# Altium project Shuttler_AMC.PrjPcb (part 13 of 20)

## Sheet Clock_Distribution_PLL.SchDoc: =ProjectName
size 420 x 297 mm; Author: T.P.; CompanyName: WUT; DrawnBy: T.P.; Organization: WUT ISE; Address1: Warsaw Univeristy of Technology; Address2: Nowowiejska 15/19; DocumentNumber: 16; Revision: 0.9; SheetNumber: 16; SheetTotal: 36; EDA_Number: ARTIQ; Projet: ARTIQ/SINARA; ModifiedBy: -; CreateDate: XX/XX/XXXX; CheckedDate: -; Title2: Clock_Distribution_PLL.SchDoc; DivGrp: ISE; Designer: G.K. and T.P.; ModifiedDate: -; ProjectName: ADC/DAC MEZZANINE
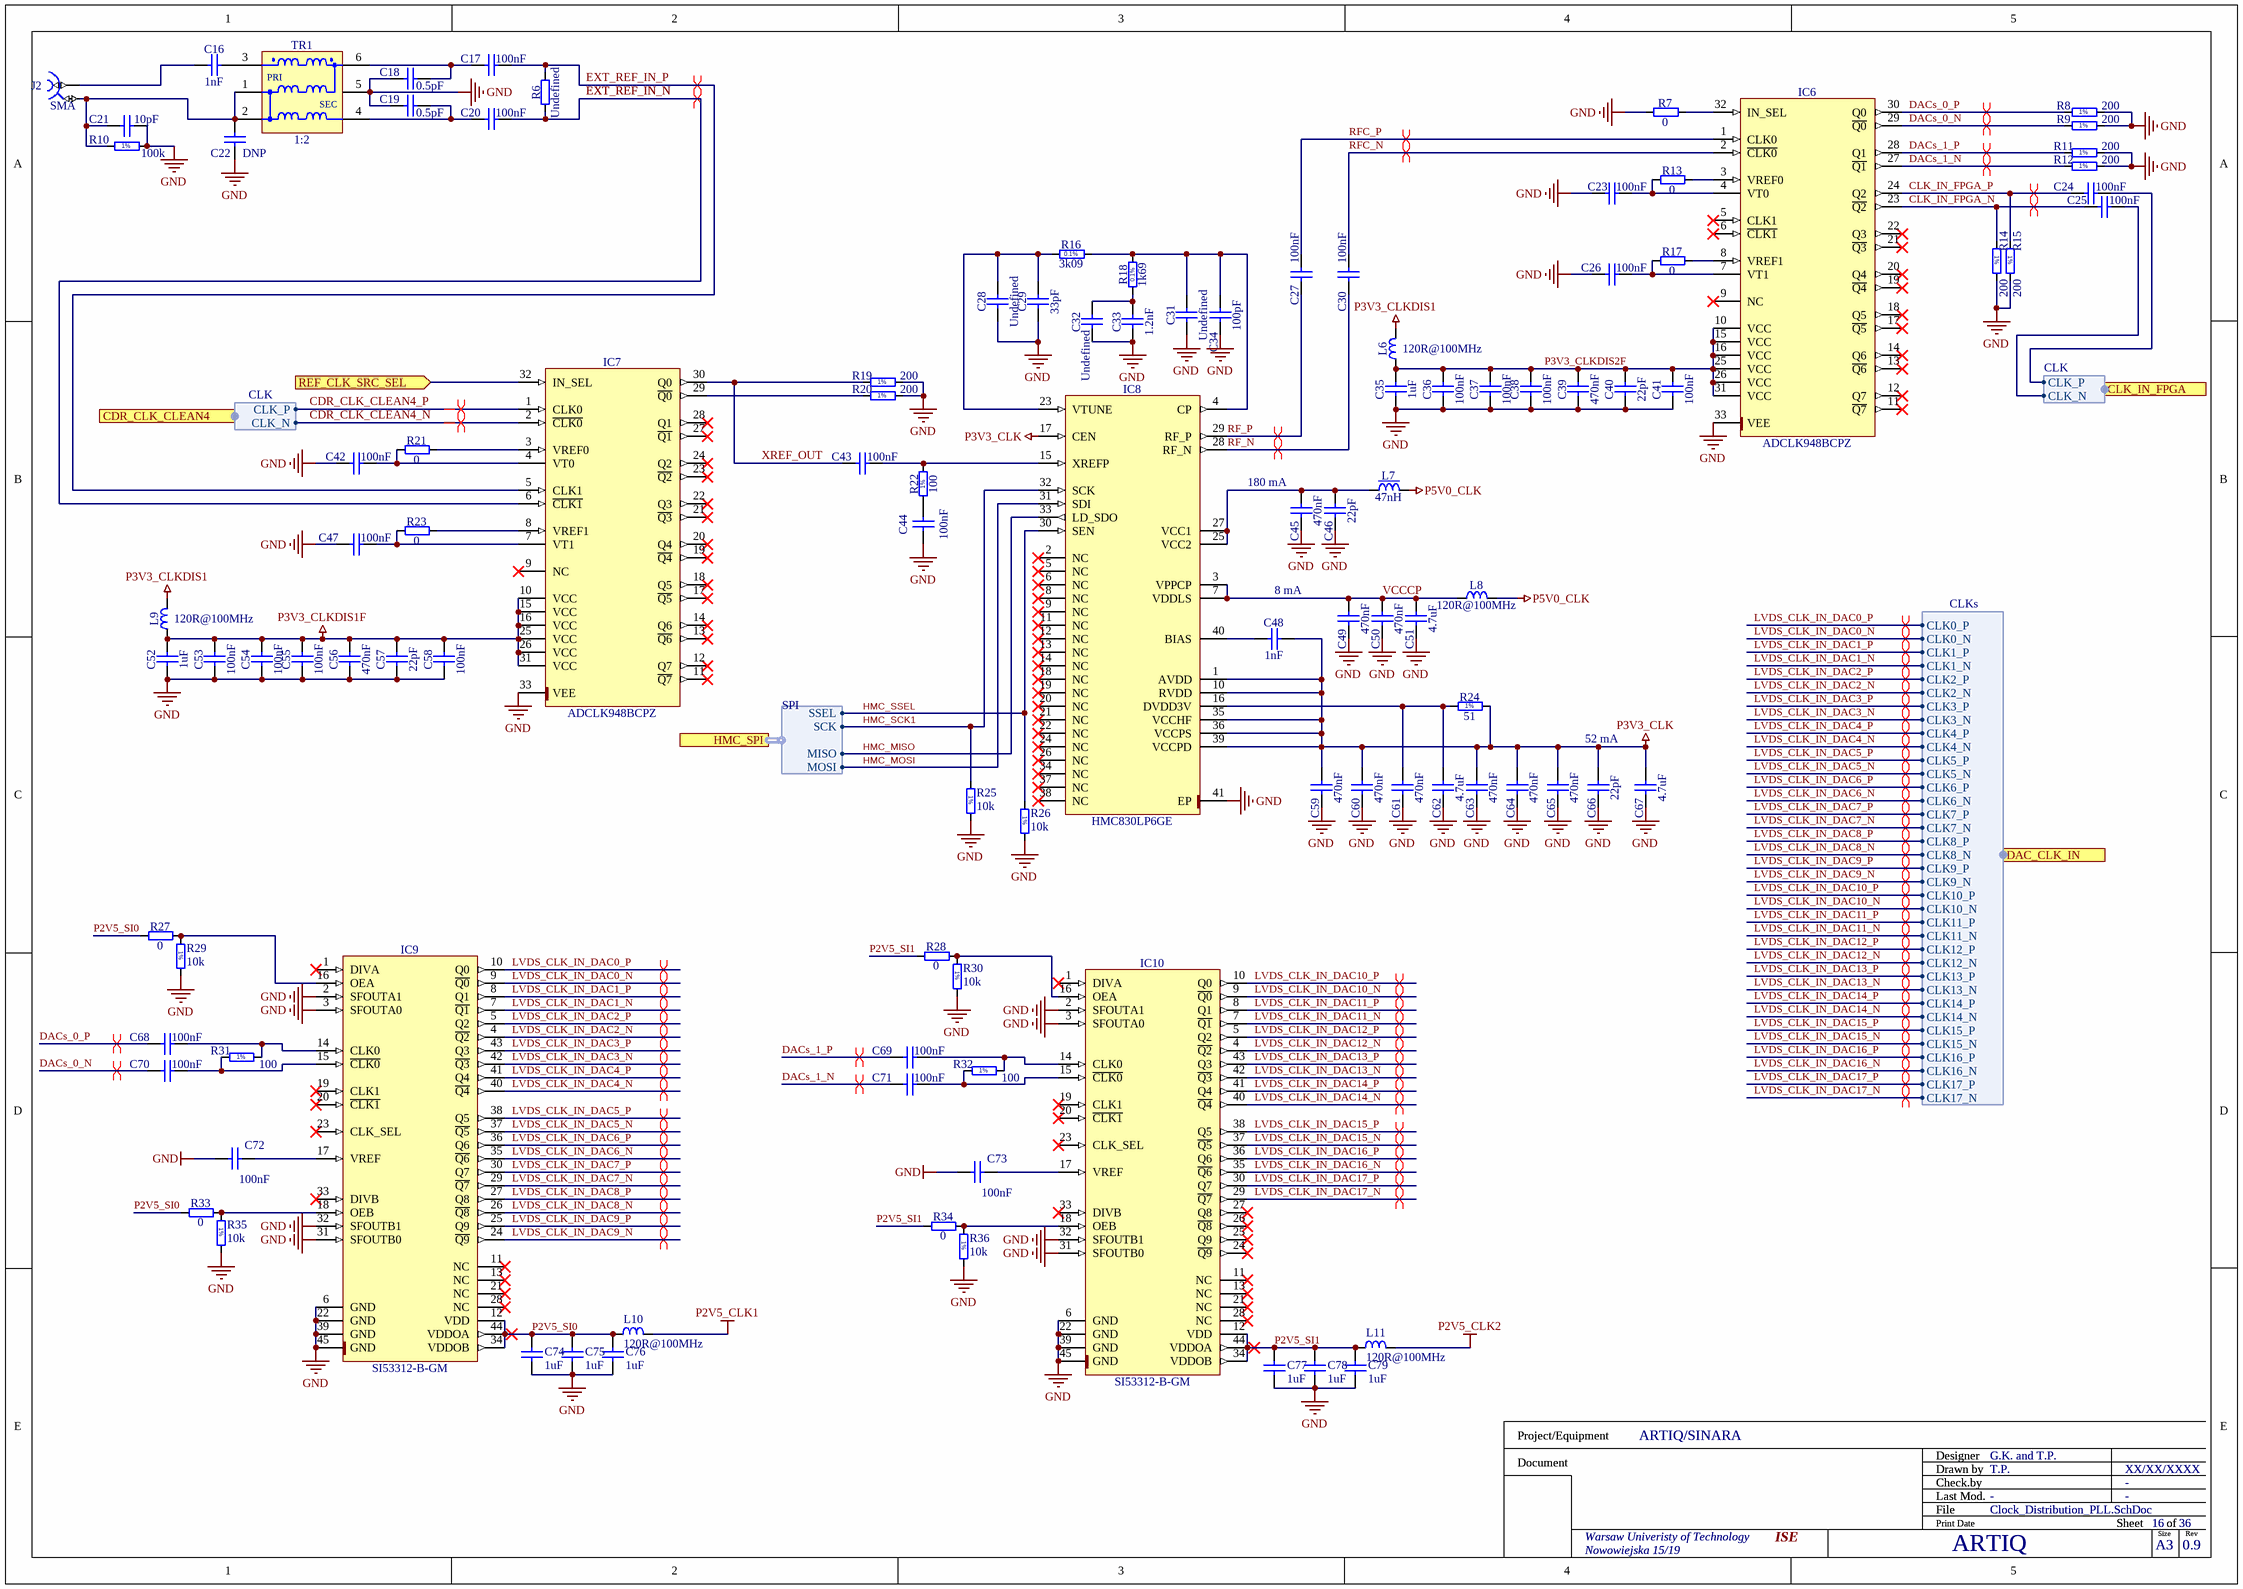
[diagram p24: Clock_Distribution_PLL.SchDoc]

### Parts
C16  1nF  [CAPC1005X55N]
C17  100nF  [CAPC0603X33N]
C18  0.5pF  [CAPC1005X50N]
C19  0.5pF  [CAPC1005X50N]
C20  100nF  [CAPC0603X33N]
C21  10pF  [CAPC1608X87N]
C22  DNP  [CAPC0603X33N]
C23  100nF  [CAPC0603X33N]
C24  100nF  [CAPC0603X33N]
C25  100nF  [CAPC0603X33N]
C26  100nF  [CAPC0603X33N]
C27  100nF  [CAPC0603X33N]
C28  Undefined  [CAPC2012X135N]
C29  33pF  [CAPC1608X87N]
C30  100nF  [CAPC0603X33N]
C31  Undefined  [CAPC2012X135N]
C32  Undefined  [CAPC2012X135N]
C33  1.2nF  [CAPC3216X140N]
C34  100pF  [CAPC1608X87N]
C35  1uF  [CAPC1005X55N]
C36  100nF  [CAPC0603X33N]
C37  100nF  [CAPC0603X33N]
C38  100nF  [CAPC0603X33N]
C39  470nF  [CAPC1005X55N]
C40  22pF  [CAPC1005X55N]
C41  100nF  [CAPC0603X33N]
C42  100nF  [CAPC0603X33N]
C43  100nF  [CAPC0603X33N]
C44  100nF  [CAPC0603X33N]
C45  470nF  [CAPC1005X55N]
C46  22pF  [CAPC1005X55N]
C47  100nF  [CAPC0603X33N]
C48  1nF  [CAPC1005X55N]
C49  470nF  [CAPC1005X55N]
C50  470nF  [CAPC1005X55N]
C51  4.7uF  [CAPC1608X90N]
C52  1uF  [CAPC1005X55N]
C53  100nF  [CAPC0603X33N]
C54  100nF  [CAPC0603X33N]
C55  100nF  [CAPC0603X33N]
C56  470nF  [CAPC1005X55N]
C57  22pF  [CAPC1005X55N]
C58  100nF  [CAPC0603X33N]
C59  470nF  [CAPC1005X55N]
C60  470nF  [CAPC1005X55N]
C61  470nF  [CAPC1005X55N]
C62  4.7uF  [CAPC1608X90N]
C63  470nF  [CAPC1005X55N]
C64  470nF  [CAPC1005X55N]
C65  470nF  [CAPC1005X55N]
C66  22pF  [CAPC1005X55N]
C67  4.7uF  [CAPC1608X90N]
C68  100nF  [CAPC0603X33N]
C69  100nF  [CAPC0603X33N]
C70  100nF  [CAPC0603X33N]
C71  100nF  [CAPC0603X33N]
C72  100nF  [CAPC1005X55N]
C73  100nF  [CAPC1005X55N]
C74  1uF  [CAPC1005X55N]
C75  1uF  [CAPC1005X55N]
C76  1uF  [CAPC1005X55N]
C77  1uF  [CAPC1005X55N]
C78  1uF  [CAPC1005X55N]
C79  1uF  [CAPC1005X55N]
IC6  ADCLK948BCPZ  [QFN50P500X500X80-33N-S285]
IC7  ADCLK948BCPZ  [QFN50P500X500X80-33N-S285]
IC8  HMC830LP6GE  [QFN50P600X600X90-41N-S475]
IC9  SI53312-B-GM  [QFN50P700X700X90-45N-S295]
IC10  SI53312-B-GM  [QFN50P700X700X90-45N-S295]
J2  SMA  [CINCH_142-0761-801]
L6  120R@100MHz  [INDC1608X95N]
L7  47nH  [INDC2014X145N]
L8  120R@100MHz  [INDC1608X95N]
L9  120R@100MHz  [INDC1608X95N]
L10  120R@100MHz  [INDC1608X95N]
L11  120R@100MHz  [INDC1608X95N]
R6  Undefined  [RESC1005X40N]
R7  0  [RESC1005X40N]
R8  200  [RESC1005X40N]
R9  200  [RESC1005X40N]
R10  100k  [RESC1608X55N]
R11  200  [RESC1005X40N]
R12  200  [RESC1005X40N]
R13  0  [RESC1005X40N]
R14  200  [RESC1005X40N]
R15  200  [RESC1005X40N]
R16  3k09  [RESC1608X55N]
R17  0  [RESC1005X40N]
R18  1k69  [RESC1608X55N]
R19  200  [RESC1005X40N]
R20  200  [RESC1005X40N]
R21  0  [RESC1005X40N]
R22  100  [RESC1005X40N]
R23  0  [RESC1005X40N]
R24  51  [RESC1005X40N]
R25  10k  [RESC1005X40N]
R26  10k  [RESC1005X40N]
R27  0  [RESC1608X55N]
R28  0  [RESC1608X55N]
R29  10k  [RESC1005X40N]
R30  10k  [RESC1005X40N]
R31  100  [RESC0603X28N]
R32  100  [RESC0603X28N]
R33  0  [RESC1608X55N]
R34  0  [RESC1608X55N]
R35  10k  [RESC1005X40N]
R36  10k  [RESC1005X40N]
TR1  1:2  [XFMR_MINI-CIRCUITS_DB1627]

### Ports
CDR_CLK_CLEAN4 (harness CLK), CLK_IN_FPGA (harness CLK), DAC_CLK_IN (harness CLKs), HMC_SPI (harness SPI), REF_CLK_SRC_SEL (in)

### Harnesses
CLK: CLK_P, CLK_N
CLKs: CLK0_P, CLK0_N, CLK1_P, CLK1_N, CLK2_P, CLK2_N, CLK3_P, CLK3_N, CLK4_P, CLK4_N, CLK5_P, CLK5_N, CLK6_P, CLK6_N, CLK7_P, CLK7_N, CLK8_P, CLK8_N, CLK9_P, CLK9_N, CLK10_P, CLK10_N, CLK11_P, CLK11_N, CLK12_P, CLK12_N, CLK13_P, CLK13_N, CLK14_P, CLK14_N, CLK15_P, CLK15_N, CLK16_P, CLK16_N, CLK17_P, CLK17_N
SPI: SCK, SSEL, MISO, MOSI

### Nets
GND: C18.1 C19.1 C21.2 C22.1 C23.1 C26.1 C28.1 C29.1 C31.1 C32.1 C33.1 C34.1 C35.1 C36.1 C37.1 C38.1 C39.1 C40.1 C41.1 C42.1 C44.1 C45.1 C46.1 C47.1 C49.1 C50.1 C51.1 C52.1 C53.1 C54.1 C55.1 C56.1 C57.1 C58.1 C59.1 C60.1 C61.1 C62.1 C63.1 C64.1 C65.1 C66.1 C67.1 C72.1 C73.1 C74.1 C75.1 C76.1 C77.1 C78.1 C79.1 IC6.33(VEE) IC7.33(VEE) IC8.41(EP) IC9.2(SFOUTA1) IC9.3(SFOUTA0) IC9.6(GND) IC9.22(GND) IC9.31(SFOUTB0) IC9.32(SFOUTB1) IC9.39(GND) IC9.45(GND) IC10.2(SFOUTA1) IC10.3(SFOUTA0) IC10.6(GND) IC10.22(GND) IC10.31(SFOUTB0) IC10.32(SFOUTB1) IC10.39(GND) IC10.45(GND) R7.1 R8.2 R9.2 R10.2 R11.2 R12.2 R14.2 R15.2 R19.2 R20.2 R25.2 R26.2 R29.2 R30.2 R35.2 R36.2 TR1.5(NC)
P2V5_CLK1: L10.2
P2V5_CLK2: L11.2
P3V3_CLK: C48.2 C59.2 C60.2 C63.2 C64.2 C65.2 C66.2 C67.2 IC8.1(AVDD) IC8.10(RVDD) IC8.17(CEN) IC8.35(VCCHF) IC8.36(VCCPS) IC8.39(VCCPD) R24.2
P3V3_CLKDIS1: L6.2 L9.2
P3V3_CLKDIS1F: C52.2 C53.2 C54.2 C55.2 C56.2 C57.2 C58.2 IC7.10(VCC) IC7.15(VCC) IC7.16(VCC) IC7.25(VCC) IC7.26(VCC) IC7.31(VCC) L9.1
P5V0_CLK: L7.2 L8.2
CDR_CLK_CLEAN4_N: IC7.2(~{CLK0}) ; port CDR_CLK_CLEAN4.CLK_N
CDR_CLK_CLEAN4_P: IC7.1(CLK0) ; port CDR_CLK_CLEAN4.CLK_P
CLK_IN_FPGA.CLK_N: C25.2 ; port CLK_IN_FPGA.CLK_N
CLK_IN_FPGA.CLK_P: C24.2 ; port CLK_IN_FPGA.CLK_P
CLK_IN_FPGA_N: C25.1 IC6.23(~{Q2}) R14.1
CLK_IN_FPGA_P: C24.1 IC6.24(Q2) R15.1
DACs_0_N: C70.1 IC6.29(~{Q0}) R9.1
DACs_0_P: C68.1 IC6.30(Q0) R8.1
DACs_1_N: C71.1 IC6.27(~{Q1}) R12.1
DACs_1_P: C69.1 IC6.28(Q1) R11.1
EXT_REF_IN_N: C20.2 IC7.6(~{CLK1}) R6.1
EXT_REF_IN_P: C17.2 IC7.5(CLK1) R6.2
HMC_MISO: IC8.33(LD_SDO) ; port HMC_SPI.MISO
HMC_MOSI: IC8.31(SDI) ; port HMC_SPI.MOSI
HMC_SCK1: IC8.32(SCK) R25.1 ; port HMC_SPI.SCK
HMC_SSEL: IC8.30(SEN) R26.1 ; port HMC_SPI.SSEL
LVDS_CLK_IN_DAC0_N: IC9.9(~{Q0}) ; port DAC_CLK_IN.CLK0_N  [project net DAC_CLK_IN.CLK0_N]
LVDS_CLK_IN_DAC0_P: IC9.10(Q0) ; port DAC_CLK_IN.CLK0_P  [project net DAC_CLK_IN.CLK0_P]
LVDS_CLK_IN_DAC1_N: IC9.7(~{Q1}) ; port DAC_CLK_IN.CLK1_N  [project net DAC_CLK_IN.CLK1_N]
LVDS_CLK_IN_DAC1_P: IC9.8(Q1) ; port DAC_CLK_IN.CLK1_P  [project net DAC_CLK_IN.CLK1_P]
LVDS_CLK_IN_DAC2_N: IC9.4(~{Q2}) ; port DAC_CLK_IN.CLK2_N  [project net DAC_CLK_IN.CLK2_N]
LVDS_CLK_IN_DAC2_P: IC9.5(Q2) ; port DAC_CLK_IN.CLK2_P  [project net DAC_CLK_IN.CLK2_P]
LVDS_CLK_IN_DAC3_N: IC9.42(~{Q3}) ; port DAC_CLK_IN.CLK3_N  [project net DAC_CLK_IN.CLK3_N]
LVDS_CLK_IN_DAC3_P: IC9.43(Q3) ; port DAC_CLK_IN.CLK3_P  [project net DAC_CLK_IN.CLK3_P]
LVDS_CLK_IN_DAC4_N: IC9.40(~{Q4}) ; port DAC_CLK_IN.CLK4_N  [project net DAC_CLK_IN.CLK4_N]
LVDS_CLK_IN_DAC4_P: IC9.41(Q4) ; port DAC_CLK_IN.CLK4_P  [project net DAC_CLK_IN.CLK4_P]
LVDS_CLK_IN_DAC5_N: IC9.37(~{Q5}) ; port DAC_CLK_IN.CLK5_N  [project net DAC_CLK_IN.CLK5_N]
LVDS_CLK_IN_DAC5_P: IC9.38(Q5) ; port DAC_CLK_IN.CLK5_P  [project net DAC_CLK_IN.CLK5_P]
LVDS_CLK_IN_DAC6_N: IC9.35(~{Q6}) ; port DAC_CLK_IN.CLK6_N  [project net DAC_CLK_IN.CLK6_N]
LVDS_CLK_IN_DAC6_P: IC9.36(Q6) ; port DAC_CLK_IN.CLK6_P  [project net DAC_CLK_IN.CLK6_P]
LVDS_CLK_IN_DAC7_N: IC9.29(~{Q7}) ; port DAC_CLK_IN.CLK7_N  [project net DAC_CLK_IN.CLK7_N]
LVDS_CLK_IN_DAC7_P: IC9.30(Q7) ; port DAC_CLK_IN.CLK7_P  [project net DAC_CLK_IN.CLK7_P]
LVDS_CLK_IN_DAC8_N: IC9.26(~{Q8}) ; port DAC_CLK_IN.CLK8_N  [project net DAC_CLK_IN.CLK8_N]
LVDS_CLK_IN_DAC8_P: IC9.27(Q8) ; port DAC_CLK_IN.CLK8_P  [project net DAC_CLK_IN.CLK8_P]
LVDS_CLK_IN_DAC9_N: IC9.24(~{Q9}) ; port DAC_CLK_IN.CLK9_N  [project net DAC_CLK_IN.CLK9_N]
LVDS_CLK_IN_DAC9_P: IC9.25(Q9) ; port DAC_CLK_IN.CLK9_P  [project net DAC_CLK_IN.CLK9_P]
LVDS_CLK_IN_DAC10_N: IC10.9(~{Q0}) ; port DAC_CLK_IN.CLK10_N  [project net DAC_CLK_IN.CLK10_N]
LVDS_CLK_IN_DAC10_P: IC10.10(Q0) ; port DAC_CLK_IN.CLK10_P  [project net DAC_CLK_IN.CLK10_P]
LVDS_CLK_IN_DAC11_N: IC10.7(~{Q1}) ; port DAC_CLK_IN.CLK11_N  [project net DAC_CLK_IN.CLK11_N]
LVDS_CLK_IN_DAC11_P: IC10.8(Q1) ; port DAC_CLK_IN.CLK11_P  [project net DAC_CLK_IN.CLK11_P]
LVDS_CLK_IN_DAC12_N: IC10.4(~{Q2}) ; port DAC_CLK_IN.CLK12_N  [project net DAC_CLK_IN.CLK12_N]
LVDS_CLK_IN_DAC12_P: IC10.5(Q2) ; port DAC_CLK_IN.CLK12_P  [project net DAC_CLK_IN.CLK12_P]
LVDS_CLK_IN_DAC13_N: IC10.42(~{Q3}) ; port DAC_CLK_IN.CLK13_N  [project net DAC_CLK_IN.CLK13_N]
LVDS_CLK_IN_DAC13_P: IC10.43(Q3) ; port DAC_CLK_IN.CLK13_P  [project net DAC_CLK_IN.CLK13_P]
LVDS_CLK_IN_DAC14_N: IC10.40(~{Q4}) ; port DAC_CLK_IN.CLK14_N  [project net DAC_CLK_IN.CLK14_N]
LVDS_CLK_IN_DAC14_P: IC10.41(Q4) ; port DAC_CLK_IN.CLK14_P  [project net DAC_CLK_IN.CLK14_P]
LVDS_CLK_IN_DAC15_N: IC10.37(~{Q5}) ; port DAC_CLK_IN.CLK15_N  [project net DAC_CLK_IN.CLK15_N]
LVDS_CLK_IN_DAC15_P: IC10.38(Q5) ; port DAC_CLK_IN.CLK15_P  [project net DAC_CLK_IN.CLK15_P]
LVDS_CLK_IN_DAC16_N: IC10.35(~{Q6}) ; port DAC_CLK_IN.CLK16_N  [project net DAC_CLK_IN.CLK16_N]
LVDS_CLK_IN_DAC16_P: IC10.36(Q6) ; port DAC_CLK_IN.CLK16_P  [project net DAC_CLK_IN.CLK16_P]
LVDS_CLK_IN_DAC17_N: IC10.29(~{Q7}) ; port DAC_CLK_IN.CLK17_N  [project net DAC_CLK_IN.CLK17_N]
LVDS_CLK_IN_DAC17_P: IC10.30(Q7) ; port DAC_CLK_IN.CLK17_P  [project net DAC_CLK_IN.CLK17_P]
P2V5_SI0: C74.2 C75.2 C76.2 IC9.12(VDD) IC9.34(VDDOB) IC9.44(VDDOA) L10.1 R27.1 R33.1
P2V5_SI1: C77.2 C78.2 C79.2 IC10.12(VDD) IC10.34(VDDOB) IC10.44(VDDOA) L11.1 R28.1 R34.1
P3V3_CLKDIS2F: C35.2 C36.2 C37.2 C38.2 C39.2 C40.2 C41.2 IC6.10(VCC) IC6.15(VCC) IC6.16(VCC) IC6.25(VCC) IC6.26(VCC) IC6.31(VCC) L6.1
REF_CLK_SEL: IC7.32(IN_SEL) ; port REF_CLK_SRC_SEL
RF_N: C30.1 IC8.28(RF_N)
RF_P: C27.1 IC8.29(RF_P)
RFC_N: C30.2 IC6.2(~{CLK0})
RFC_P: C27.2 IC6.1(CLK0)
VCCCP: C49.2 C50.2 C51.2 IC8.3(VPPCP) IC8.7(VDDLS) L8.1
XREF_OUT: C43.1 IC7.30(Q0) R19.1
NetC16_1: C16.1 J2.1
NetC16_2: C16.2 TR1.3(P1)
NetC17_1: C17.1 C18.2 TR1.6(S1)
NetC19_2: C19.2 C20.1 TR1.4(S1)
NetC21_1: C21.1 C22.2 J2.2 R10.1 TR1.1(P1) TR1.2(P1)
NetC23_2: C23.2 IC6.4(VT0) R13.1
NetC26_2: C26.2 IC6.7(VT1) R17.1
NetC28_2: C28.2 C29.2 IC8.23(VTUNE) R16.1
NetC31_2: C31.2 C34.2 IC8.4(CP) R16.2 R18.2
NetC32_2: C32.2 C33.2 R18.1
NetC42_2: C42.2 IC7.4(VT0) R21.1
NetC43_2: C43.2 IC8.15(XREFP) R22.2
NetC44_2: C44.2 R22.1
NetC45_2: C45.2 C46.2 IC8.25(VCC2) IC8.27(VCC1) L7.1
NetC47_2: C47.2 IC7.7(VT1) R23.1
NetC48_1: C48.1 IC8.40(BIAS)
NetC61_2: C61.2 C62.2 IC8.16(DVDD3V) R24.1
NetC68_2: C68.2 IC9.14(CLK0) R31.2
NetC69_2: C69.2 IC10.14(CLK0) R32.2
NetC70_2: C70.2 IC9.15(~{CLK0}) R31.1
NetC71_2: C71.2 IC10.15(~{CLK0}) R32.1
NetC72_2: C72.2 IC9.17(VREF)
NetC73_2: C73.2 IC10.17(VREF)
NetIC6_3: IC6.3(VREF0) R13.2
NetIC6_8: IC6.8(VREF1) R17.2
NetIC6_32: IC6.32(IN_SEL) R7.2
NetIC7_3: IC7.3(VREF0) R21.2
NetIC7_8: IC7.8(VREF1) R23.2
NetIC7_29: IC7.29(~{Q0}) R20.1
NetIC9_16: IC9.16(OEA) R27.2 R29.1
NetIC9_18: IC9.18(OEB) R33.2 R35.1
NetIC10_16: IC10.16(OEA) R28.2 R30.1
NetIC10_18: IC10.18(OEB) R34.2 R36.1

Not connected (* = marked no-connect by the designer): IC6 5(CLK1)* 6(~{CLK1})* 9(NC)* 11(~{Q7})* 12(Q7)* 13(~{Q6})* 14(Q6)* 17(~{Q5})* 18(Q5)* 19(~{Q4})* 20(Q4)* 21(~{Q3})* 22(Q3)*; IC7 9(NC)* 11(~{Q7})* 12(Q7)* 13(~{Q6})* 14(Q6)* 17(~{Q5})* 18(Q5)* 19(~{Q4})* 20(Q4)* 21(~{Q3})* 22(Q3)* 23(~{Q2})* 24(Q2)* 27(~{Q1})* 28(Q1)*; IC8 2(NC)* 5(NC)* 6(NC)* 8(NC)* 9(NC)* 11(NC)* 12(NC)* 13(NC)* 14(NC)* 18(NC)* 19(NC)* 20(NC)* 21(NC)* 22(NC)* 24(NC)* 26(NC)* 34(NC)* 37(NC)* 38(NC)*; IC9 1(DIVA)* 11(NC)* 13(NC)* 19(CLK1)* 20(~{CLK1})* 21(NC)* 23(CLK_SEL)* 28(NC)* 33(DIVB)*; IC10 1(DIVA)* 11(NC)* 13(NC)* 19(CLK1)* 20(~{CLK1})* 21(NC)* 23(CLK_SEL)* 24(~{Q9})* 25(Q9)* 26(~{Q8})* 27(Q8)* 28(NC)* 33(DIVB)*

### Layout directives
differential pair; differential pair class Diff_100Ohm: EXT_REF_IN_N, EXT_REF_IN_P, RF_N, RF_P, RFC_N, RFC_P
differential pair; differential pair class LVPECL: CDR_CLK_CLEAN4_N, CDR_CLK_CLEAN4_P, CLK_IN_FPGA_N, CLK_IN_FPGA_P, DACs_0_N, DACs_0_P, DACs_1_N, DACs_1_P
differential pair: DAC_CLK_IN.CLK0_N, DAC_CLK_IN.CLK0_P, DAC_CLK_IN.CLK1_N, DAC_CLK_IN.CLK1_P, DAC_CLK_IN.CLK2_N, DAC_CLK_IN.CLK2_P, DAC_CLK_IN.CLK3_N, DAC_CLK_IN.CLK3_P, DAC_CLK_IN.CLK4_N, DAC_CLK_IN.CLK4_P, DAC_CLK_IN.CLK5_N, DAC_CLK_IN.CLK5_P, DAC_CLK_IN.CLK6_N, DAC_CLK_IN.CLK6_P, DAC_CLK_IN.CLK7_N, DAC_CLK_IN.CLK7_P, DAC_CLK_IN.CLK8_N, DAC_CLK_IN.CLK8_P, DAC_CLK_IN.CLK9_N, DAC_CLK_IN.CLK9_P, DAC_CLK_IN.CLK10_N, DAC_CLK_IN.CLK10_P, DAC_CLK_IN.CLK11_N, DAC_CLK_IN.CLK11_P, DAC_CLK_IN.CLK12_N, DAC_CLK_IN.CLK12_P, DAC_CLK_IN.CLK13_N, DAC_CLK_IN.CLK13_P, DAC_CLK_IN.CLK14_N, DAC_CLK_IN.CLK14_P, DAC_CLK_IN.CLK15_N, DAC_CLK_IN.CLK15_P, DAC_CLK_IN.CLK16_N, DAC_CLK_IN.CLK16_P, DAC_CLK_IN.CLK17_N, DAC_CLK_IN.CLK17_P, DACs_0_N, DACs_0_P, DACs_1_N, DACs_1_P
differential pair; differential pair class LVDS: DAC_CLK_IN.CLK0_N, DAC_CLK_IN.CLK0_P, DAC_CLK_IN.CLK1_N, DAC_CLK_IN.CLK1_P, DAC_CLK_IN.CLK2_N, DAC_CLK_IN.CLK2_P, DAC_CLK_IN.CLK3_N, DAC_CLK_IN.CLK3_P, DAC_CLK_IN.CLK4_N, DAC_CLK_IN.CLK4_P, DAC_CLK_IN.CLK5_N, DAC_CLK_IN.CLK5_P, DAC_CLK_IN.CLK6_N, DAC_CLK_IN.CLK6_P, DAC_CLK_IN.CLK7_N, DAC_CLK_IN.CLK7_P, DAC_CLK_IN.CLK8_N, DAC_CLK_IN.CLK8_P, DAC_CLK_IN.CLK9_N, DAC_CLK_IN.CLK9_P, DAC_CLK_IN.CLK10_N, DAC_CLK_IN.CLK10_P, DAC_CLK_IN.CLK11_N, DAC_CLK_IN.CLK11_P, DAC_CLK_IN.CLK12_N, DAC_CLK_IN.CLK12_P, DAC_CLK_IN.CLK13_N, DAC_CLK_IN.CLK13_P, DAC_CLK_IN.CLK14_N, DAC_CLK_IN.CLK14_P, DAC_CLK_IN.CLK15_N, DAC_CLK_IN.CLK15_P, DAC_CLK_IN.CLK16_N, DAC_CLK_IN.CLK16_P, DAC_CLK_IN.CLK17_N, DAC_CLK_IN.CLK17_P

### Notes on the sheet
- (near C45) 180 mA
- 8 mA
- 52 mA
- Project/Equipment
- Document
- Designer
- Drawn by
- Check.by
- File
- Last Mod.
- Print Date
- Sheet
- Size
- A3
- of
- Rev
- (in symbol R0201_100R_1%_0.05W_200PPM) 1%
- (in symbol R0402_10K_1%_0.0625W_100PPM) 1%
- (in symbol R0402_51R_1%_0.0625W_100PPM) 1%
- (in symbol R0402_100R_1%_0.0625W_100PPM) 1%
- (in symbol R0402_200R_1%_0.0625W_100PPM) 1%
- (in symbol R0603_1K69_0.1%_0.063W_10PPM) 0.1%
- (in symbol R0603_3K09_0.1%_0.063W_10PPM) 0.1%
- (in symbol R0603_100K_1%_0.1W_100PPM) 1%
- (in symbol XFMR_MINI-CIRCUITS_TCM2-43X+) PRI; SEC

### Library data of the parts
C16 C48 = CC0402_1NF_50V_10%_X7R: Non-polarised capacitor; Part Description: SMD Multilayer Chip Ceramic Capacitor; Manufacturer: GENERIC; Manufacturer1 Part Number: 223858715623; Voltage: 50V; TC: X7R; Tolerance: ±10%; Part Number: CC0402_1NF_50V_10%_X7R; Component Kind: Standard; Component Type: Standard; Pin Count: 2; Value: 1nF; Status: Not Recommended; Manufacturer Part Number: CC0402_1NF_50V_10%_X7R; Case: 0402; Mounted: Yes; Socket: No; SMD: Yes; Sense: No; Manufacturer1 Example: PHYCOMP; Manufacturer1 ComponentHeight: 0.55mm; HelpURL: \\cern.ch\dfs\Applications\Altium\Datasheets\CC0402_X7R_PHYCOMP.pdf; Author: CERN DEM JLC; CreateDate: 03.12.2007; LatestRevisionDate: 03.12.2007
C17 C20 C22-C27 C30 C36-C38 C41-C44 C47 C53-C55 C58 C68-C71 = CC0201_100NF_6.3V_10%_X5R: as C1022 on sheet Amplifier; Part Number: CC0201_100NF_6.3V_10%_X5R; Component Kind: Standard; Component Type: Standard; Pin Count: 2; Status: Not Recommended; Manufacturer Part Number: CC0201_100NF_6.3V_10%_X5R; Case: 0201; Mounted: Yes; Socket: No; SMD: Yes; Sense: No; Manufacturer1 Example: AVX; Manufacturer1 ComponentHeight: 0.33mm; HelpURL: \\cern.ch\dfs\Applications\Altium\Datasheets\CC0201_X5R_AVX.pdf; Author: CERN DEM JLC; CreateDate: 03.12.2007; LatestRevisionDate: 03.12.2007
  C17 C20 C23-C27 C30 C36-C38 C41-C44 C47 C53-C55 C58 C68-C71: Value: 100nF
  C22: Value: DNP
C18 C19 = CC0402_0.5PF_25V_0.05PF_AVX_04023J0R5ABSTR: Non-polarised capacitor; Part Description: Thin-Film Chip Capacitors for RF Signal and Power Applications, Accu-P Series; Manufacturer: AVX; Voltage: 25V; Tolerance: ±0.05pF; Part Number: CC0402_0.5PF_25V_0.05PF_AVX_04023J0R5ABSTR; Component Kind: Standard; Component Type: Standard; Pin Count: 2; Value: 0.5pF; Status: None; Manufacturer Part Number: 04023J0R5ABSTR; Case: 0402; Mounted: Yes; Socket: No; SMD: Yes; Sense: No; ComponentHeight: 0.5mm; HelpURL: \\cern.ch\dfs\Applications\Altium\Datasheets\CC0402_AVX_ACCU-P.pdf; Author: CERN DEM JLC; CreateDate: 22.02.2017; LatestRevisionDate: 22.02.2017
C21 = CC0603_10PF_50V_5%_NP0: Non-polarised capacitor; Part Description: SMD Multilayer Chip Ceramic Capacitor; Manufacturer: GENERIC; Manufacturer1 Part Number: 223886715109; Voltage: 50V; TC: C0G/NP0; Tolerance: ±5%; Part Number: CC0603_10PF_50V_5%_NP0; Component Kind: Standard; Component Type: Standard; Pin Count: 2; Value: 10pF; Status: Preferred; Manufacturer Part Number: CC0603_10PF_50V_5%_NP0; Case: 0603; Mounted: Yes; Socket: No; SMD: Yes; Sense: No; Manufacturer1 Example: PHYCOMP; Manufacturer1 ComponentHeight: 0.87mm; HelpURL: \\cern.ch\dfs\Applications\Altium\Datasheets\CC0603_NP0_PHYCOMP.pdf; Author: CERN DEM JLC; CreateDate: 03.12.2007; LatestRevisionDate: 03.12.2007
C28 C31 C32 = CC0805_1.2NF_50V_10%_X7R: Non-polarised capacitor; Part Number: Capacitor - non polarized CAPC2012X135N; Part Description: Reserved Footprint For 0805(2012) Chip Ceramic Capacitor; Manufacturer Part Number: CC0805_NO-VALUE; Mounted: No; Component Kind: Standard; Component Type: Standard; Pin Count: 2; Value: Undefined; Manufacturer: Undefined; Case: 0805; Socket: No; SMD: Yes; Sense: No; Manufacturer1 ComponentHeight: 1.35mm; HelpURL: \\cern.ch\dfs\Applications\Altium\Datasheets\CC0805_X7R_PHYCOMP.pdf; Author: CERN DEM JLC; CreateDate: 03.12.2007; LatestRevisionDate: 03.12.2007
C29 = CC0603_33PF_50V_5%_NP0: Non-polarised capacitor; Part Description: SMD Multilayer Chip Ceramic Capacitor; Manufacturer: GENERIC; Manufacturer1 Part Number: 223886715339; Voltage: 50V; TC: C0G/NP0; Tolerance: ±5%; Part Number: CC0603_33PF_50V_5%_NP0; Component Kind: Standard; Component Type: Standard; Pin Count: 2; Value: 33pF; Status: Preferred; Manufacturer Part Number: CC0603_33PF_50V_5%_NP0; Case: 0603; Mounted: Yes; Socket: No; SMD: Yes; Sense: No; Manufacturer1 Example: PHYCOMP; Manufacturer1 ComponentHeight: 0.87mm; HelpURL: \\cern.ch\dfs\Applications\Altium\Datasheets\CC0603_NP0_PHYCOMP.pdf; Author: CERN DEM JLC; CreateDate: 03.12.2007; LatestRevisionDate: 03.12.2007
C33 = CC1206_1.2NF_50V_5%_NP0: Non-polarised capacitor; Part Description: SMD Multilayer Chip Ceramic Capacitor; Manufacturer: GENERIC; Manufacturer1 Part Number: 2238 863 15122; Voltage: 50V; TC: C0G/NP0; Tolerance: ±5%; Part Number: CC1206_1.2NF_50V_5%_NP0; Component Kind: Standard; Component Type: Standard; Pin Count: 2; Value: 1.2nF; Status: Preferred; Manufacturer Part Number: CC1206_1.2NF_50V_5%_NP0; Case: 1206; Mounted: Yes; Socket: No; SMD: Yes; Sense: No; Manufacturer1 Example: PHYCOMP; Manufacturer1 ComponentHeight: 1.25mm; HelpURL: \\cern.ch\dfs\Applications\Altium\Datasheets\CC1206_NP0_PHYCOMP.pdf; Author: CERN DEM JLC; CreateDate: 03.12.2007; LatestRevisionDate: 03.12.2007
C34 = CC0603_100PF_50V_5%_NP0: Non-polarised capacitor; Part Description: SMD Multilayer Chip Ceramic Capacitor; Manufacturer: GENERIC; Manufacturer1 Part Number: 223886715101; Voltage: 50V; TC: C0G/NP0; Tolerance: ±5%; Part Number: CC0603_100PF_50V_5%_NP0; Component Kind: Standard; Component Type: Standard; Pin Count: 2; Value: 100pF; Status: Preferred; Manufacturer Part Number: CC0603_100PF_50V_5%_NP0; Case: 0603; Mounted: Yes; Socket: No; SMD: Yes; Sense: No; Manufacturer1 Example: PHYCOMP; Manufacturer1 ComponentHeight: 0.87mm; HelpURL: \\cern.ch\dfs\Applications\Altium\Datasheets\CC0603_NP0_PHYCOMP.pdf; Author: CERN DEM JLC; CreateDate: 03.12.2007; LatestRevisionDate: 03.12.2007
C35 C52 C74-C79 = CC0402_1UF_16V_10%_X5R: Non-polarised capacitor; Part Description: SMD Multilayer Chip Ceramic Capacitor; Manufacturer: GENERIC; Manufacturer1 Part Number: C1005X5R1C105KT; Voltage: 16V; TC: X5R; Tolerance: ±10%; Part Number: CC0402_1UF_16V_10%_X5R; Component Kind: Standard; Component Type: Standard; Pin Count: 2; Value: 1uF; Status: Preferred; Manufacturer Part Number: CC0402_1UF_16V_10%_X5R; Case: 0402; Mounted: Yes; Socket: No; SMD: Yes; Sense: No; Manufacturer1 Example: TDK; Manufacturer1 ComponentHeight: 0.55mm; HelpURL: \\cern.ch\dfs\Applications\Altium\Datasheets\CC0402_X5R_TDK_C.pdf; Author: CERN DEM JLC
  C35 C52: CreateDate: 25.10.2012; LatestRevisionDate: 25.10.2012
  C74-C79: CreateDate: 2012-10-25; LatestRevisionDate: 2012-10-25
C39 C45 C49 C50 C56 C59-C61 C63-C65 = CC0402_470NF_16V_10%_X5R: Non-polarised capacitor; Part Description: SMD Multilayer Chip Ceramic Capacitor; Manufacturer: GENERIC; Manufacturer1 Part Number: C1005X5R1C105KT; Voltage: 16V; TC: X5R; Tolerance: ±10%; Part Number: CC0402_470NF_16V_10%_X5R; Component Kind: Standard; Component Type: Standard; Pin Count: 2; Value: 470nF; Status: Preferred; Manufacturer Part Number: CC0402_470NF_16V_10%_X5R; Case: 0402; Mounted: Yes; Socket: No; SMD: Yes; Sense: No; Manufacturer1 Example: TDK; Manufacturer1 ComponentHeight: 0.55mm; HelpURL: \\cern.ch\dfs\Applications\Altium\Datasheets\CC0402_X5R_TDK_C.pdf; Author: CERN DEM JLC; CreateDate: 25.10.2012; LatestRevisionDate: 25.10.2012
C40 C46 C57 C66 = CC0402_22PF_50V_5%_C0G: Non-polarised capacitor; Part Description: SMD Multilayer Chip Ceramic Capacitor; Manufacturer: GENERIC; Manufacturer1 Part Number: C0402C220J5GACTU; Voltage: 50V; TC: C0G/NP0; Tolerance: ±5%; Part Number: CC0402_22PF_50V_5%_C0G; Component Kind: Standard; Component Type: Standard; Pin Count: 2; Value: 22pF; Status: Preferred; Manufacturer Part Number: CC0402_22PF_50V_5%_C0G; Case: 0402; Mounted: Yes; Socket: No; SMD: Yes; Sense: No; Manufacturer1 Example: KEMET; Manufacturer1 ComponentHeight: 0.55mm; HelpURL: \\cern.ch\dfs\Applications\Altium\Datasheets\CC0805_C0G_KEMET_(Commercial Grade).pdf; Author: CERN DEM JLC; CreateDate: 03.12.2007; LatestRevisionDate: 03.12.2007
C51 C62 C67 = CC0603_4.7UF_25V_10%_X5R: Non-polarised capacitor; Part Description: SMD Multilayer Chip Ceramic Capacitor; Manufacturer: GENERIC; Manufacturer1 Part Number: GRM188R61E475KE11D; Voltage: 25V; TC: X5R; Tolerance: ±10%; Part Number: CC0603_4.7UF_25V_10%_X5R; Component Kind: Standard; Component Type: Standard; Pin Count: 2; Value: 4.7uF; Status: None; Manufacturer Part Number: CC0603_4.7UF_25V_10%_X5R; Case: 0603; Mounted: Yes; Socket: No; SMD: Yes; Sense: No; Manufacturer1 Example: MURATA; Manufacturer1 ComponentHeight: 0.95mm; HelpURL: \\cern.ch\dfs\Applications\Altium\Datasheets\CC0603_MURATA_GRM188R61E475KE11D.pdf; Author: CERN DEM JLC; CreateDate: 10.11.2014; LatestRevisionDate: 10.11.2014
C72 C73 = CC0402_100NF_16V_10%_X5R: Non-polarised capacitor; Part Description: SMD Multilayer Chip Ceramic Capacitor; Manufacturer: GENERIC; Manufacturer1 Part Number: GRM155R61C104KA88D; Voltage: 16V; TC: X5R; Tolerance: ±10%; Part Number: CC0402_100NF_16V_10%_X5R; Component Kind: Standard; Component Type: Standard; Pin Count: 2; Value: 100nF; Status: None; Manufacturer Part Number: CC0402_100NF_16V_10%_X5R; Case: 0402; Mounted: Yes; Socket: No; SMD: Yes; Sense: No; Manufacturer1 Example: MURATA; Manufacturer1 ComponentHeight: 0.55mm; HelpURL: \\cern.ch\dfs\Applications\Altium\Datasheets\CC0402_X5R_MURATA_GRM.pdf; Author: CERN DEM JLC; CreateDate: 10.12.2013; LatestRevisionDate: 10.12.2013
IC6 IC7 = ADCLK948BCPZ: Two Selectable Inputs, 8 LVPECL Outputs, SiGe Clock Fanout Buffer; Manufacturer: ANALOG DEVICES; PressFit: No; Bonding: No; Part Number: ADCLK948BCPZ; Component Kind: Standard; Component Type: Standard; Device: ADCLK948BCPZ; PackageDescription: QFN, 0.50mm Pitch, Square; 8 Pin X 8 Pin, 5mm X 5mm X 1.00mm H body (w/thermal tab 2.85 X 2.85mm),  IPC Medium Density; Part Description: Two Selectable Inputs, 8 LVPECL Outputs, SiGe Clock Fanout Buffer; Manufacturer Part Number: ADCLK948BCPZ; Pin Count: 33; Case: QFN32; Mounted: Yes; Socket: No; SMD: Yes; Sense: No; ComponentHeight: 0.8mm; Author: CERN DEM MR; HelpURL: \\cern.ch\dfs\Applications\Altium\Datasheets\ADCLK948BCPZ.pdf; CreateDate: 30.11.2016; LatestRevisionDate: 30.11.2016
IC8 = HMC830LP6GE: Fractional-N PLL With Integrated VCO, 25 to 3000MHz; Manufacturer: HITTITE MICROWAVE CORP; PressFit: No; Bonding: No; Part Number: HMC830LP6GE; Component Kind: Standard; Component Type: Standard; Device: HMC830LP6GE; PackageDescription: QFN, 0.50mm Pitch, Square; 40 Pin, 4.00mm L X 4.00mm W X 1.00mm H Body (w/thermal Tab 2.95 X 2.95mm), IPC Medium Density; Part Description: Fractional-N PLL With Integrated VCO, 25 to 3000MHz; Manufacturer Part Number: HMC830LP6GE; Pin Count: 41; Case: QFN40; Mounted: Yes; Socket: No; SMD: Yes; Sense: No; ComponentHeight: 0.9mm; Author: CERN DEM JMW; HelpURL: \\cern.ch\dfs\Applications\Altium\Datasheets\HMC830LP6GE.pdf; CreateDate: 17.08.2016; LatestRevisionDate: 17.08.2016
IC9 IC10 = SI53312-B-GM: 2 Input/10 Output, Low Jitter Universal Buffer/Level Translator With 2:1 Input Mux (<1.25 GHZ); Manufacturer: SILICON LABS; PressFit: No; Bonding: No; Part Number: SI53312-B-GM; Component Kind: Standard; Component Type: Standard; Device: SI53312-B-GM; PackageDescription: QFN, 0.50mm Pitch, Square; 44 Pin, 7.00mm L X 7.00mm W X 0.90mm H Body (w/Thermal Tab 2.95mm X 2.95mm), IPC Medium Density; Part Description: 2 Input/10 Output, Low Jitter Universal Buffer/Level Translator With 2:1 Input Mux (<1.25 GHZ); Manufacturer Part Number: SI53312-B-GM; Pin Count: 45; Case: QFN44; Mounted: Yes; Socket: No; SMD: Yes; Sense: No; ComponentHeight: 0.9mm; Author: CERN DEM MR; HelpURL: \\cern.ch\dfs\Applications\Altium\Datasheets\SI53312-B-GM.pdf; CreateDate: 02.10.2017; LatestRevisionDate: 02.10.2017
J2 = CINCH_142-0761-801: Part Description: SMA 50 Ohm High Frequency End Launch SMA Jack Receptacle (10mil Pin); Manufacturer: CINCH CONNECTIVITY; PressFit: No; Part Number: CINCH_142-0761-801; Component Kind: Standard; Component Type: Standard; Pin Count: 2; Family: SMA; Mounted: Yes; Socket: No; SMD: No; Sense: No; Status: None; Manufacturer Part Number: 142-0761-801; ComponentHeight: 5.53mm; HelpURL: \\cern.ch\dfs\Applications\Altium\Datasheets\CINCH_142-0761-801.pdf; Author: CERN DEM JLC; CreateDate: 21.04.2015; LatestRevisionDate: 21.04.2015
L6 L8-L11 = IND0603_MURATA_BLM18PG121SN1D: as L1000 on sheet Amplifier; Part Number: IND0603_MURATA_BLM18PG121SN1D; Component Kind: Standard; Component Type: Standard; Pin Count: 2; Value: 120R@100MHz; Status: None; Manufacturer Part Number: BLM18PG121SN1D; Case: 0603; Mounted: Yes; Socket: No; SMD: Yes; Sense: No; ComponentHeight: 0.95mm; HelpURL: \\cern.ch\dfs\Applications\Altium\Datasheets\IND0603_MURATA_BLM18P.pdf; Author: CERN DEM BC
  L6 L8 L9: CreateDate: 27.07.2015; LatestRevisionDate: 27.07.2015
  L10 L11: CreateDate: 2015-07-27; LatestRevisionDate: 2015-07-27
L7 = IND0805_47NH_5%_EPCOS_B82498B: Inductor With Core; Part Description: SMT Inductor SIMID Series; Manufacturer: EPCOS; Manufacturer Part Number: B82498B3470J; Power: 500mA; Resistance: 0.13R; Tolerance: ±5%; Part Number: IND0805_47NH_5%_EPCOS_B82498B; Component Kind: Standard; Component Type: Standard; Pin Count: 2; Value: 47nH; Status: Preferred; Case: 0805; Mounted: Yes; Socket: No; SMD: Yes; Sense: No; ComponentHeight: 1.45mm; HelpURL: \\cern.ch\dfs\Applications\Altium\Datasheets\IND0805_EPCOS_B82498B.pdf; Author: CERN DEM JLC; CreateDate: 11.02.2008; LatestRevisionDate: 26.06.2008
R6 = R0402_NO-VALUE: Resistor; Part Description: Reserved Footprint For a 0402 (1005) Chip Resistor; PressFit: No; Mounted: No; Part Number: R0402_NO-VALUE; Component Kind: Standard; Component Type: Standard; Pin Count: 2; Value: Undefined; Status: None; Manufacturer: Undefined; Manufacturer Part Number: R0402_NO-VALUE; Case: 0402; Sense: No; Socket: No; SMD: Yes; Manufacturer1 Example: Undefined; Manufacturer1 Part Number: Undefined; Manufacturer1 ComponentHeight: Undefined; HelpURL: Undefined; Author: CERN DEM JLC; CreateDate: 03.12.2007; LatestRevisionDate: 13.03.2008
R7 R13 R17 R21 R23 = R0402_0R_JUMPER: Resistor; Part Description: 1A (0.05R Max DC Resistance) Zero Ohm Jumper; Manufacturer: GENERIC; Manufacturer1 Part Number: 232270591001L; PressFit: No; Part Number: R0402_0R_JUMPER; Component Kind: Standard; Component Type: Standard; Pin Count: 2; Value: 0; Status: Not Recommended; Manufacturer Part Number: R0402_0R_JUMPER; Case: 0402; Mounted: Yes; Sense: No; Socket: No; SMD: Yes; Manufacturer1 Example: YAGEO PHYCOMP; Manufacturer1 ComponentHeight: 0.4mm; HelpURL: \\cern.ch\dfs\Applications\Altium\Datasheets\R0402_Phycomp_RC0402.pdf; Author: CERN DEM JLC; CreateDate: 03.12.2007; LatestRevisionDate: 17.10.2012
R8 R9 R11 R12 R14 R15 R19 R20 = R0402_200R_1%_0.0625W_100PPM: Resistor - 1%; Part Description: General Purpose Thick Film Chip Resistor; Manufacturer: GENERIC; Manufacturer1 Part Number: 232270672001L; TC: ±100ppm/°C; PressFit: No; Part Number: R0402_200R_1%_0.0625W_100PPM; Component Kind: Standard; Component Type: Standard; Pin Count: 2; Value: 200; Status: Not Recommended; Power: 0.0625W; Tolerance: ±1%; Manufacturer Part Number: R0402_200R_1%_0.0625W_100PPM; Case: 0402; Mounted: Yes; Sense: No; Socket: No; SMD: Yes; Manufacturer1 Example: YAGEO PHYCOMP; Manufacturer1 ComponentHeight: 0.4mm; HelpURL: \\cern.ch\dfs\Applications\Altium\Datasheets\R0402_Phycomp_RC0402.pdf; Author: CERN DEM JLC; CreateDate: 03.12.2007; LatestRevisionDate: 17.10.2012
R10 = R0603_100K_1%_0.1W_100PPM: Resistor - 1%; Part Description: General Purpose Thick Film Chip Resistor; Manufacturer: GENERIC; Manufacturer1 Part Number: NRC06F1003TRF; Power: 0.1W; TC: ±100ppm/°C; PressFit: No; Part Number: R0603_100K_1%_0.1W_100PPM; Component Kind: Standard; Component Type: Standard; Pin Count: 2; Value: 100k; Status: Preferred; Tolerance: ±1%; Manufacturer Part Number: R0603_100K_1%_0.1W_100PPM; Case: 0603; Mounted: Yes; Sense: No; Socket: No; SMD: Yes; Manufacturer1 Example: NIC COMPONENT; Manufacturer1 ComponentHeight: 0.55mm; HelpURL: \\cern.ch\dfs\Applications\Altium\Datasheets\R0603_NIC_NRC.pdf; Author: CERN DEM JLC; CreateDate: 03.12.2007; LatestRevisionDate: 13.03.2008
R16 = R0603_3K09_0.1%_0.063W_10PPM: Resistor - 0.1%; Part Description: Thin Film Chip Resistor; Manufacturer: GENERIC; Manufacturer1 Part Number: RN73C1J3K09BTDF; Power: 0.063W; TC: ±10ppm; PressFit: No; Part Number: R0603_3K09_0.1%_0.063W_10PPM; Component Kind: Standard; Component Type: Standard; Pin Count: 2; Value: 3k09; Status: Not Recommended; Tolerance: ±0.1%; Manufacturer Part Number: R0603_3K09_0.1%_0.063W_10PPM; Case: 0603; Mounted: Yes; Sense: No; Socket: No; SMD: Yes; Manufacturer1 Example: TYCO HOLSWORTHY; Manufacturer1 ComponentHeight: 0.5mm; HelpURL: \\cern.ch\dfs\Applications\Altium\Datasheets\R0603_Tyco_RN73.pdf; Author: CERN DEM JLC; CreateDate: 03.12.2007; LatestRevisionDate: 13.03.2008
R18 = R0603_1K69_0.1%_0.063W_10PPM: Resistor - 0.1%; Part Description: Thin Film Chip Resistor; Manufacturer: GENERIC; Manufacturer1 Part Number: RN73C1J1K69BTDF; Power: 0.063W; TC: ±10ppm; PressFit: No; Part Number: R0603_1K69_0.1%_0.063W_10PPM; Component Kind: Standard; Component Type: Standard; Pin Count: 2; Value: 1k69; Status: Not Recommended; Tolerance: ±0.1%; Manufacturer Part Number: R0603_1K69_0.1%_0.063W_10PPM; Case: 0603; Mounted: Yes; Sense: No; Socket: No; SMD: Yes; Manufacturer1 Example: TYCO HOLSWORTHY; Manufacturer1 ComponentHeight: 0.5mm; HelpURL: \\cern.ch\dfs\Applications\Altium\Datasheets\R0603_Tyco_RN73.pdf; Author: CERN DEM JLC; CreateDate: 03.12.2007; LatestRevisionDate: 13.03.2008
R22 = R0402_100R_1%_0.0625W_100PPM: Resistor - 1%; Part Description: General Purpose Thick Film Chip Resistor; Manufacturer: GENERIC; Manufacturer1 Part Number: 232270671001L; TC: ±100ppm/°C; PressFit: No; Part Number: R0402_100R_1%_0.0625W_100PPM; Component Kind: Standard; Component Type: Standard; Pin Count: 2; Value: 100; Status: Not Recommended; Power: 0.0625W; Tolerance: ±1%; Manufacturer Part Number: R0402_100R_1%_0.0625W_100PPM; Case: 0402; Mounted: Yes; Sense: No; Socket: No; SMD: Yes; Manufacturer1 Example: YAGEO PHYCOMP; Manufacturer1 ComponentHeight: 0.4mm; HelpURL: \\cern.ch\dfs\Applications\Altium\Datasheets\R0402_Phycomp_RC0402.pdf; Author: CERN DEM JLC; CreateDate: 03.12.2007; LatestRevisionDate: 17.10.2012
R24 = R0402_51R_1%_0.0625W_100PPM: Resistor - 1%; Part Description: General Purpose Thick Film Chip Resistor; Manufacturer: GENERIC; Manufacturer1 Part Number: 232270675109L; TC: ±100ppm/°C; PressFit: No; Part Number: R0402_51R_1%_0.0625W_100PPM; Component Kind: Standard; Component Type: Standard; Pin Count: 2; Value: 51; Status: Not Recommended; Power: 0.0625W; Tolerance: ±1%; Manufacturer Part Number: R0402_51R_1%_0.0625W_100PPM; Case: 0402; Mounted: Yes; Sense: No; Socket: No; SMD: Yes; Manufacturer1 Example: YAGEO PHYCOMP; Manufacturer1 ComponentHeight: 0.4mm; HelpURL: \\cern.ch\dfs\Applications\Altium\Datasheets\R0402_Phycomp_RC0402.pdf; Author: CERN DEM JLC; CreateDate: 03.12.2007; LatestRevisionDate: 17.10.2012
R25 R26 R29 R30 R35 R36 = R0402_10K_1%_0.0625W_100PPM: Resistor - 1%; Part Description: General Purpose Thick Film Chip Resistor; Manufacturer: GENERIC; Manufacturer1 Part Number: 232270671003L; TC: ±100ppm/°C; Part Number: R0402_10K_1%_0.0625W_100PPM; Component Kind: Standard; Component Type: Standard; Pin Count: 2; Value: 10k; Status: Not recommended; Power: 0.0625W; Tolerance: ±1%; Manufacturer Part Number: R0402_10K_1%_0.0625W_100PPM; Case: 0402; Mounted: Yes; Sense: No; Socket: No; SMD: Yes; Manufacturer1 Example: YAGEO PHYCOMP; Manufacturer1 ComponentHeight: 0.4mm; HelpURL: \\cern.ch\dfs\Applications\Altium\Datasheets\R0402_Phycomp_RC0402.pdf; Author: CERN DEM JLC; CreateDate: 03.12.2007; LatestRevisionDate: 17.10.2012
R27 R28 R33 R34 = R0603_0R_JUMPER: Resistor; Part Description: 1A (0.05R Max DC Resistance) Zero Ohm Jumper; Manufacturer: GENERIC; Manufacturer1 Part Number: NRC06Z0; Part Number: R0603_0R_JUMPER; Component Kind: Standard; Component Type: Standard; Pin Count: 2; Value: 0; Status: Preferred; Manufacturer Part Number: R0603_0R_JUMPER; Case: 0603; Mounted: Yes; Sense: No; Socket: No; SMD: Yes; Manufacturer1 Example: NIC COMPONENT; Manufacturer1 ComponentHeight: 0.55mm; HelpURL: \\cern.ch\dfs\Applications\Altium\Datasheets\R0603_NIC_NRC.pdf; Author: CERN DEM JLC; CreateDate: 03.12.2007; LatestRevisionDate: 13.03.2008
R31 R32 = R0201_100R_1%_0.05W_200PPM: as R1017 on sheet DAC_LTC2000; Part Number: R0201_100R_1%_0.05W_200PPM; Component Kind: Standard; Component Type: Standard; Pin Count: 2; Value: 100; Status: Not Recommended; Tolerance: ±1%; Manufacturer Part Number: R0201_100R_1%_0.05W_200PPM; Case: 0201; Mounted: Yes; Sense: No; Socket: No; SMD: Yes; Manufacturer1 Example: VISHAY; Manufacturer1 ComponentHeight: 0.27mm; HelpURL: \\cern.ch\dfs\Applications\Altium\Datasheets\R0201_VISHAY_CRCW0201 e3.pdf; Author: CERN DEM JLC; CreateDate: 13.11.2014; LatestRevisionDate: 13.11.2014
TR1 = XFMR_MINI-CIRCUITS_TCM2-43X+: 50 OHMS 10 to 4000 MHz RF Transformer; Power: 0.4W; Part Number: XFMR_MINI-CIRCUITS_TCM2-43X+; Component Kind: Standard; Component Type: Standard; Pin Count: 6; Value: 1:2; Status: None; Part Description: 50 Ohms 10 to 4000MHz RF Transformer; Manufacturer: MINI-CIRCUITS; Manufacturer Part Number: TCM2-43X+; Mounted: Yes; Socket: No; Sense: No; SMD: Yes; ComponentHeight: 4.06mm; HelpURL: \\cern.ch\dfs\Applications\Altium\Datasheets\XFMR_MINI-CIRCUITS_TCM2-43X+.pdf; Author: CERN DEM BC; CreateDate: 12.02.2016; LatestRevisionDate: 12.02.2016